# Altium schematic sheet edison_gpio.SchDoc: Edison Gateway - GPIO
size Letter; Author: Ye-Sheng Kuo; DocumentNumber: 3; Revision: 3; SheetNumber: 3; SheetTotal: 10
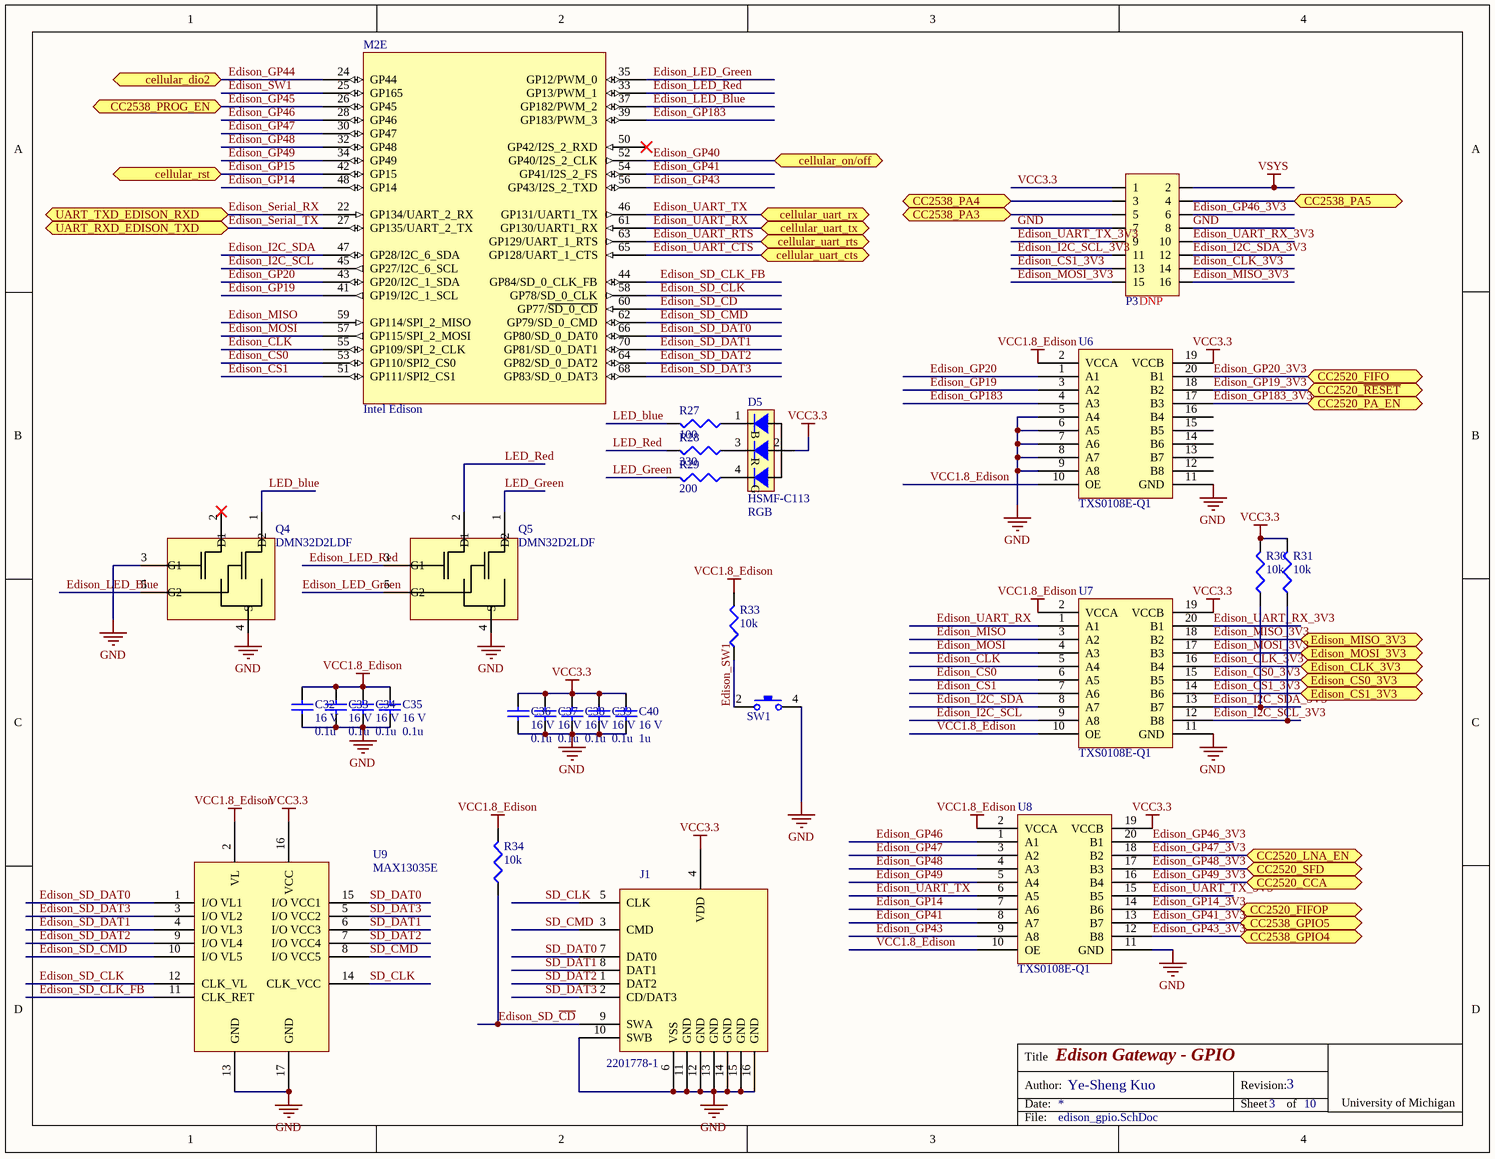
[diagram p0: edison_gpio.SchDoc]

## Parts
C32  voltage rated: 16 V  [0402]  (hidden comment: 0.1u)
C33  voltage rated: 16 V  [0402]  (hidden comment: 0.1u)
C34  voltage rated: 16 V  [0402]  (hidden comment: 0.1u)
C35  voltage rated: 16 V  [0402]  (hidden comment: 0.1u)
C36  voltage rated: 16 V  [0402]  (hidden comment: 0.1u)
C37  voltage rated: 16 V  [0402]  (hidden comment: 0.1u)
C38  voltage rated: 16 V  [0402]  (hidden comment: 0.1u)
C39  voltage rated: 16 V  [0402]  (hidden comment: 0.1u)
C40  voltage rated: 16 V  [0402]  (hidden comment: 1u)
D5  HSMF-C113  value RGB  [HSMF]
J1  2201778-1  [2201778-1]
M2  Intel Edison  [Intel Edison mating]  (part E of 5)
P3  Note: DNP  [2x8 header]  (hidden comment: 2 x 8 header)
Q4  DMN32D2LDF  [SOT-353-5]
Q5  DMN32D2LDF  [SOT-353-5]
R27  100  [0402]
R28  330  [0402]
R29  200  [0402]
R30  10k  [0402]
R31  10k  [0402]
R33  10k  [0402]
R34  10k  [0402]
SW1  KT11P4SA2M35LFG  [KT11PXSA2M]  (value not drawn)
U6  TXS0108E-Q1  [TSSOP-20]
U7  TXS0108E-Q1  [TSSOP-20]
U8  TXS0108E-Q1  [TSSOP-20]
U9  MAX13035E  [TQFN-16]

## Ports
CC2520_CCA, CC2520_FIFO, CC2520_FIFOP, CC2520_LNA_EN, CC2520_PA_EN, CC2520_SFD, CC2520_~{RESET}, CC2538_GPIO4, CC2538_GPIO5, CC2538_PA3, CC2538_PA4, CC2538_PA5, CC2538_PROG_EN, cellular_dio2, cellular_on/off, cellular_rst, cellular_uart_cts, cellular_uart_rts, cellular_uart_rx, cellular_uart_tx, Edison_CLK_3V3, Edison_CS0_3V3, Edison_CS1_3V3, Edison_MISO_3V3, Edison_MOSI_3V3, UART_RXD_EDISON_TXD, UART_TXD_EDISON_RXD

## Nets
GND: C32.2 C33.2 C34.2 C35.2 C36.2 C37.2 C38.2 C39.2 C40.2 J1.6(VSS) J1.10(SWB) J1.11(GND) J1.12(GND) J1.13(GND) J1.14(GND) J1.15(GND) J1.16(GND) P3.7 P3.8 Q4.3(G1) Q4.4(S) Q5.4(S) SW1.4 U6.5(A4) U6.6(A5) U6.7(A6) U6.8(A7) U6.9(A8) U6.11(GND) U7.11(GND) U8.11(GND) U9.13(GND) U9.17(GND)
VCC1.8_Edison: C32.1 C33.1 C34.1 C35.1 R33.1 R34.1 U6.2(VCCA) U6.10(OE) U7.2(VCCA) U7.10(OE) U8.2(VCCA) U8.10(OE) U9.2(VL)
VCC3.3: C36.1 C37.1 C38.1 C39.1 C40.1 D5.2 J1.4(VDD) P3.1 R30.1 R31.1 U6.19(VCCB) U7.19(VCCB) U8.19(VCCB) U9.16(VCC)
VSYS: P3.2
CC2538_PA3: P3.5 ; port CC2538_PA3
CC2538_PA4: P3.3 ; port CC2538_PA4
CC2538_PA5: P3.4 ; port CC2538_PA5
Edison_CLK: M2.55(GP109/SPI_2_CLK) U7.5(A4)
Edison_CLK_3V3: P3.14 U7.16(B4) ; port Edison_CLK_3V3
Edison_CS0: M2.53(GP110/SPI2_CS0) U7.6(A5)
Edison_CS0_3V3: U7.15(B5) ; port Edison_CS0_3V3
Edison_CS1: M2.51(GP111/SPI2_CS1) U7.7(A6)
Edison_CS1_3V3: P3.13 U7.14(B6) ; port Edison_CS1_3V3
Edison_GP14: M2.48(GP14) U8.7(A6)
Edison_GP14_3V3: U8.14(B6) ; port CC2520_FIFOP
Edison_GP15: M2.42(GP15) ; port cellular_rst
Edison_GP19: M2.41(GP19/I2C_1_SCL) U6.3(A2)
Edison_GP19_3V3: U6.18(B2) ; port CC2520_~{RESET}
Edison_GP20: M2.43(GP20/I2C_1_SDA) U6.1(A1)
Edison_GP20_3V3: U6.20(B1) ; port CC2520_FIFO
Edison_GP40: M2.52(GP40/I2S_2_CLK) ; port cellular_on/off
Edison_GP41: M2.54(GP41/I2S_2_FS) U8.8(A7)
Edison_GP41_3V3: U8.13(B7) ; port CC2538_GPIO5
Edison_GP43: M2.56(GP43/I2S_2_TXD) U8.9(A8)
Edison_GP43_3V3: U8.12(B8) ; port CC2538_GPIO4
Edison_GP44: M2.24(GP44) ; port cellular_dio2
Edison_GP45: M2.26(GP45) ; port CC2538_PROG_EN
Edison_GP46: M2.28(GP46) U8.1(A1)
Edison_GP46_3V3: P3.6 U8.20(B1)
Edison_GP47: M2.30(GP47) U8.3(A2)
Edison_GP47_3V3: U8.18(B2) ; port CC2520_LNA_EN
Edison_GP48: M2.32(GP48) U8.4(A3)
Edison_GP48_3V3: U8.17(B3) ; port CC2520_SFD
Edison_GP49: M2.34(GP49) U8.5(A4)
Edison_GP49_3V3: U8.16(B4) ; port CC2520_CCA
Edison_GP183: M2.39(GP183/PWM_3) U6.4(A3)
Edison_GP183_3V3: U6.17(B3) ; port CC2520_PA_EN
Edison_I2C_SCL: M2.45(GP27/I2C_6_SCL) U7.9(A8)
Edison_I2C_SCL_3V3: P3.11 R31.2 U7.12(B8)
Edison_I2C_SDA: M2.47(GP28/I2C_6_SDA) U7.8(A7)
Edison_I2C_SDA_3V3: P3.12 R30.2 U7.13(B7)
Edison_LED_Blue: M2.37(GP182/PWM_2) Q4.5(G2)
Edison_LED_Green: M2.35(GP12/PWM_0) Q5.5(G2)
Edison_LED_Red: M2.33(GP13/PWM_1) Q5.3(G1)
Edison_MISO: M2.59(GP114/SPI_2_MISO) U7.3(A2)
Edison_MISO_3V3: P3.16 U7.18(B2) ; port Edison_MISO_3V3
Edison_MOSI: M2.57(GP115/SPI_2_MOSI) U7.4(A3)
Edison_MOSI_3V3: P3.15 U7.17(B3) ; port Edison_MOSI_3V3
Edison_SD_~{CD}: J1.9(SWA) M2.60(GP77/~{SD_0_CD}) R34.2
Edison_SD_CLK: M2.58(GP78/SD_0_CLK) U9.12(CLK_VL)
Edison_SD_CLK_FB: M2.44(GP84/SD_0_CLK_FB) U9.11(CLK_RET)
Edison_SD_CMD: M2.62(GP79/SD_0_CMD) U9.10(I/O_VL5)
Edison_SD_DAT0: M2.66(GP80/SD_0_DAT0) U9.1(I/O_VL1)
Edison_SD_DAT1: M2.70(GP81/SD_0_DAT1) U9.4(I/O_VL3)
Edison_SD_DAT2: M2.64(GP82/SD_0_DAT2) U9.9(I/O_VL4)
Edison_SD_DAT3: M2.68(GP83/SD_0_DAT3) U9.3(I/O_VL2)
Edison_Serial_RX: M2.22(GP134/UART_2_RX) ; port UART_TXD_EDISON_RXD
Edison_Serial_TX: M2.27(GP135/UART_2_TX) ; port UART_RXD_EDISON_TXD
Edison_SW1: M2.25(GP165) R33.2 SW1.2
Edison_UART_CTS: M2.65(GP128/UART_1_CTS) ; port cellular_uart_cts
Edison_UART_RTS: M2.63(GP129/UART_1_RTS) ; port cellular_uart_rts
Edison_UART_RX: M2.61(GP130/UART1_RX) U7.1(A1) ; port cellular_uart_tx
Edison_UART_RX_3V3: P3.10 U7.20(B1)
Edison_UART_TX: M2.46(GP131/UART1_TX) U8.6(A5) ; port cellular_uart_rx
Edison_UART_TX_3V3: P3.9 U8.15(B5)
LED_blue: Q4.1(D2) R27.1
LED_Green: Q5.1(D2) R29.1
LED_Red: Q5.2(D1) R28.1
SD_CLK: J1.5(CLK) U9.14(CLK_VCC)
SD_CMD: J1.3(CMD) U9.8(I/O_VCC5)
SD_DAT0: J1.7(DAT0) U9.15(I/O_VCC1)
SD_DAT1: J1.8(DAT1) U9.6(I/O_VCC3)
SD_DAT2: J1.1(DAT2) U9.7(I/O_VCC4)
SD_DAT3: J1.2(CD/DAT3) U9.5(I/O_VCC2)
NetD5_1: D5.1 R27.2
NetD5_3: D5.3 R28.2
NetD5_4: D5.4 R29.2

Not connected (* = marked no-connect by the designer): M2 50(GP42/I2S_2_RXD)*; Q4 2(D1)*; U6 12(B8) 13(B7) 14(B6) 15(B5) 16(B4)

## Notes on the sheet
- Title
- Date:
- Author:
- Revision:
- Sheet
- of
- University of Michigan
- File:
- (in symbol HSMF-C113) B; R; G

## Library data of the parts
C32-C39 = GRM155R71C104KA88D: 0.10µF ±10% 16V Ceramic Capacitor X7R 0402; Manufacture: Murata; tolerance: 10%; package: 0402; Supplier 1: Digi-Key; Supplier Part Number 1: 490-3261-1-ND; Value: 0.1u; Temperature Coefficient: X7R; Manufacturer Part Number: GRM155R71C104KA88D
C40 = C1005X6S1C105K050BC: 1µF ±10% 16V Ceramic Capacitor X6S 0402; Manufacture: TDK; tolerance: 10%; package: 0402; Supplier 1: Digi-Key; Supplier Part Number 1: 445-9086-1-ND; Value: 1u; Temperature Coefficient: X6S; Manufacturer Part Number: C1005X6S1C105K050BC
D5 = HSMF-C113: Red, Green, Blue (RGB) 626nm Red, 572nm Green, 470nm Blue LED Indication - Discrete 1.9V Red, 2V Green, 3.4V Blue 4-SMD; Manufacturer: Broadcom Limited; Supplier 1: Digi-Key; Supplier Part Number 1: 516-2232-1-ND; Manufacturer Part Number: HSMF-C113; Wavelength: 626nm Red, 572nm Green, 470nm Blue
J1 = 2201778-1: Micro SD Slot; Supplier 1: Digi-Key; Supplier Part Number 1: A118117CT-ND
M2 = Intel Edison: Note: Mating connector: H124603CT-ND
P3 = 2 x 8 header: 100 mils standard header; Supplier 1: Digi-Key; Supplier Part Number 1: 609-3220-ND
Q4 Q5 = DMN32D2LDF: Common Source Dual N-Channel MOSFET; Supplier 1: Digi-Key; Supplier Part Number 1: DMN32D2LDF-7DICT-ND
R27 = CRCW0402100RFKED: RES SMD 100 OHM 1% 1/16W 0402; Manufacturer: Vishay Dale; Temperature Coefficient: 100 ppm/C; Tolerance: 1%; Power: 1/16 W; package: 0402; Supplier 1: Digi-Key; Supplier Part Number 1: 541-100LCT-ND; value: 100; Manufacturer Part Number: CRCW0402100RFKED
R28 = CRCW0402330RFKED: RES SMD 330 OHM 1% 1/16W 0402; Manufacturer: Vishay Dale; Temperature Coefficient: 100 ppm/C; Tolerance: 1%; Power: 1/16 W; package: 0402; Supplier 1: Digi-Key; Supplier Part Number 1: 541-330LCT-ND; value: 330; Manufacturer Part Number: CRCW0402330RFKED
R29 = CRCW0402200RFKED: RES SMD 200 OHM 1% 1/16W 0402; Manufacturer: Vishay Dale; Temperature Coefficient: 100 ppm/C; Tolerance: 1%; Power: 1/16 W; package: 0402; Supplier 1: Digi-Key; Supplier Part Number 1: 541-200LCT-ND; value: 200; Manufacturer Part Number: CRCW0402200RFKED
R30 R31 R33 R34 = CRCW040210K0FKED: RES SMD 10K OHM 1% 1/16W 0402; Manufacturer: Vishay Dale; Temperature Coefficient: 100 ppm/C; Tolerance: 1%; Power: 1/16 W; package: 0402; Supplier 1: Digi-Key; Supplier Part Number 1: 541-10.0KLCT-ND; value: 10k; Manufacturer Part Number: CRCW040210K0FKED
SW1 = KT11P4SA2M35LFG: Tactile Switch SPST-NO Side Actuated Surface Mount, Right Angl; Supplier 1: Digi-Key; Supplier Part Number 1: CKN1858CT-ND
U6-U8 = TXS0108E-Q1: TXS0108E-Q1 8-Bit Bi-directional, Level-Shifting, Voltage Translator  for Open-Drain and Push-Pull Applications; Supplier 1: Digi-Key; Supplier Part Number 1: 296-42401-1-ND
U9 = MAX13035E: 6-Channel High-Speed Logic-Level Translators; Supplier 1: Digi-Key; Supplier Part Number 1: MAX13035EETE+-ND